# EAGLE design ChargerTimer_V3hack (EAGLE 6.4)
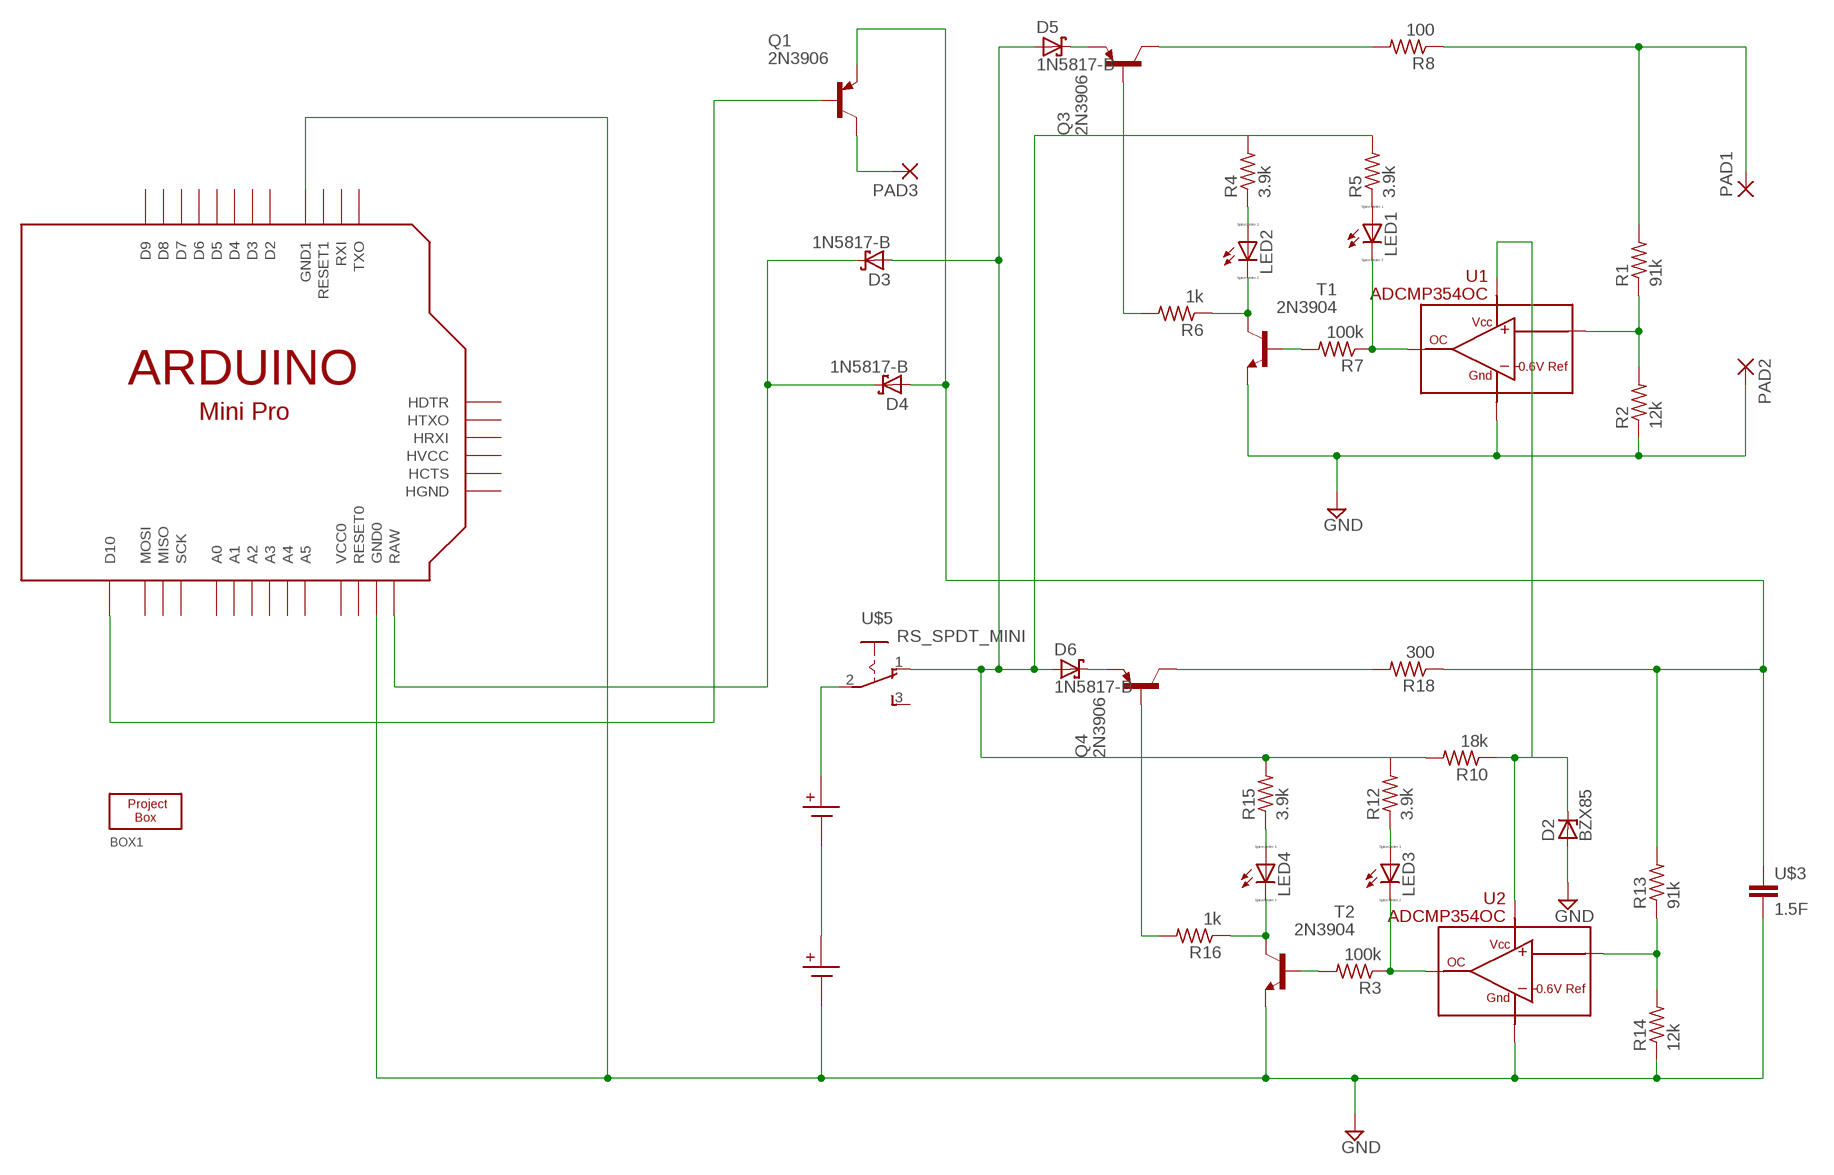
[diagram p0: schematic, sheet 1]

## Parts
BOX1  RS_BOX_4IN  [RS_BOX_OUTLINE_4IN]
D2  BZX85  [DO41Z10]
D3  1N5817-B  [DO41-7.6]
D4  1N5817-B  [DO41-7.6]
D5  1N5817-B  [DO41-7.6]
D6  1N5817-B  [DO41-7.6]
LED1  LED_ELD260  [LED_LD260]
LED2  LED_ELD260  [LED_LD260]
LED3  LED_ELD260  [LED_LD260]
LED4  LED_ELD260  [LED_LD260]
PAD1  2,15/1,0  [2,15/1,0]
PAD2  2,15/1,0  [2,15/1,0]
PAD3  2,15/1,0  [2,15/1,0]
Q1  2N3906  [TO92]
Q3  2N3906  [TO92]
Q4  2N3906  [TO92]
R1  91k  R-US_0207/7  [0207/7]
R2  12k  R-US_0207/7  [0207/7]
R3  100k  R-US_0207/7  [0207/7]
R4  3.9k  R-US_0207/7  [0207/7]
R5  3.9k  R-US_0207/7  [0207/7]
R6  1k  R-US_0207/7  [0207/7]
R7  100k  R-US_0207/7  [0207/7]
R8  100  R-US_0207/7  [0207/7]
R10  18k  R-US_0207/7  [0207/7]
R12  3.9k  R-US_0207/7  [0207/7]
R13  91k  R-US_0207/7  [0207/7]
R14  12k  R-US_0207/7  [0207/7]
R15  3.9k  R-US_0207/7  [0207/7]
R16  1k  R-US_0207/7  [0207/7]
R18  300  R-US_0207/7  [0207/7]
T1  2N3904  [TO92]
T2  2N3904  [TO92]
U1  ADCMP354OC  [ADCMP35X]
U2  ADCMP354OC  [ADCMP35X]
U$1  BH1000G  [BH1000G]
U$2  BH1000G  [BH1000G]
U$3  1.5F  C1000X850  [SUPERCAP1.0/0.85H]
U$4  ARDUINOMINI  [ARDUINOMINI]
U$5  RS_SPDT_MINI  [RS_SPDT_MINI]

## Nets
GND: D2.A PAD2.1(P) R2.1 R14.1 T1.3(E) T2.3(E) U1.P2(GND) U2.P2(GND) U$2.NEG$2(P2) U$3.P$2 U$4.P$9(GND1) U$4.P$20(GND0)
N$1: R1.1 R2.2 U1.P1(IN)
N$2: Q3.1(C) R8.2
N$3: LED1.K(C) R7.1 U1.P3(OUT)
N$4: LED1.A R5.1
N$5: LED2.A R4.1
N$6: LED2.K(C) R6.1 T1.1(C)
N$7: Q3.2(B) R6.2
N$8: PAD1.1(P) R1.2 R8.1
N$9: R3.2 T2.2(B)
N$10: D4.A Q1.3(E) R13.2 R18.1 U$3.P$1
N$11: U$1.POS$1(P1) U$5.2(P)
N$12: U$1.NEG$2(P2) U$2.POS$1(P1)
N$13: R7.2 T1.2(B)
N$15: D2.C R10.1 U1.P4(VCC) U2.P4(VCC)
N$16: R13.1 R14.2 U2.P1(IN)
N$17: LED3.K(C) R3.1 U2.P3(OUT)
N$18: LED3.A R12.1
N$19: LED4.A R15.1
N$20: LED4.K(C) R16.1 T2.1(C)
N$21: Q4.2(B) R16.2
N$22: Q4.1(C) R18.2
N$24: PAD3.1(P) Q1.1(C)
N$25: D3.C D4.C U$4.P$19(RAW)
N$26: Q1.2(B) U$4.P$30(D10)
N$28: D3.A D5.A D6.A R4.2 R5.2 R10.2 R12.2 R15.2 U$5.1(O)
N$29: D5.C Q3.3(E)
N$30: D6.C Q4.3(E)
Unconnected: U$4.P$1(D9) U$4.P$2(D8) U$4.P$3(D7) U$4.P$4(D6) U$4.P$5(D5) U$4.P$6(D4) U$4.P$7(D3) U$4.P$8(D2) U$4.P$10(RESET1) U$4.P$11(RXI) U$4.P$12(TXO) U$4.P$13(HDTR) U$4.P$14(HTXO) U$4.P$15(HRXI) U$4.P$16(HVCC) U$4.P$17(HCTS) U$4.P$18(HGND) U$4.P$21(RESET0) U$4.P$22(VCC0) U$4.P$23(A3) U$4.P$24(A2) U$4.P$25(A1) U$4.P$26(A0) U$4.P$27(SCK) U$4.P$28(MISO) U$4.P$29(MOSI) U$4.P$34(A4) U$4.P$35(A5) U$5.3(S)

## Library data of the parts
BOX1 = mymechanical:RS_BOX_4IN
D2 = diode:BZX85: Z DIODE
D3-D6 = diode:1N581*: 1.0A SCHOTTKY BARRIER RECTIFIER Source: http://www.diodes.com/datasheets/ds23001.pdf
LED1-LED4 = eagle-ltspice:LED_E: LED Source: http://www.osram.convergy.de Source: www.luxeon.com Source: www.kingbright.com; SPICEMODEL: NONE; SPICEPREFIX: D; SPICETYPE: diode
PAD1-PAD3 = wirepad:2,15/1,0: THROUGH-HOLE PAD
Q1 Q3 Q4 = transistor-pnp:2N3906: PNP Transistor
R1-R8 R10 R12-R16 R18 = rcl:R-US_: RESISTOR, American symbol
T1 T2 = transistor:2N3904: NPN TRANSISTOR
U1 U2 = mydevices:ADCMP354OC
U$1 U$2 = mymechanical:BH1000G: CR2477 Battery vertical holder
U$3 = mypassives:C1000X850
U$4 = adafruit:ARDUINOMINI
U$5 = mymechanical:RS_SPDT_MINI

## Board
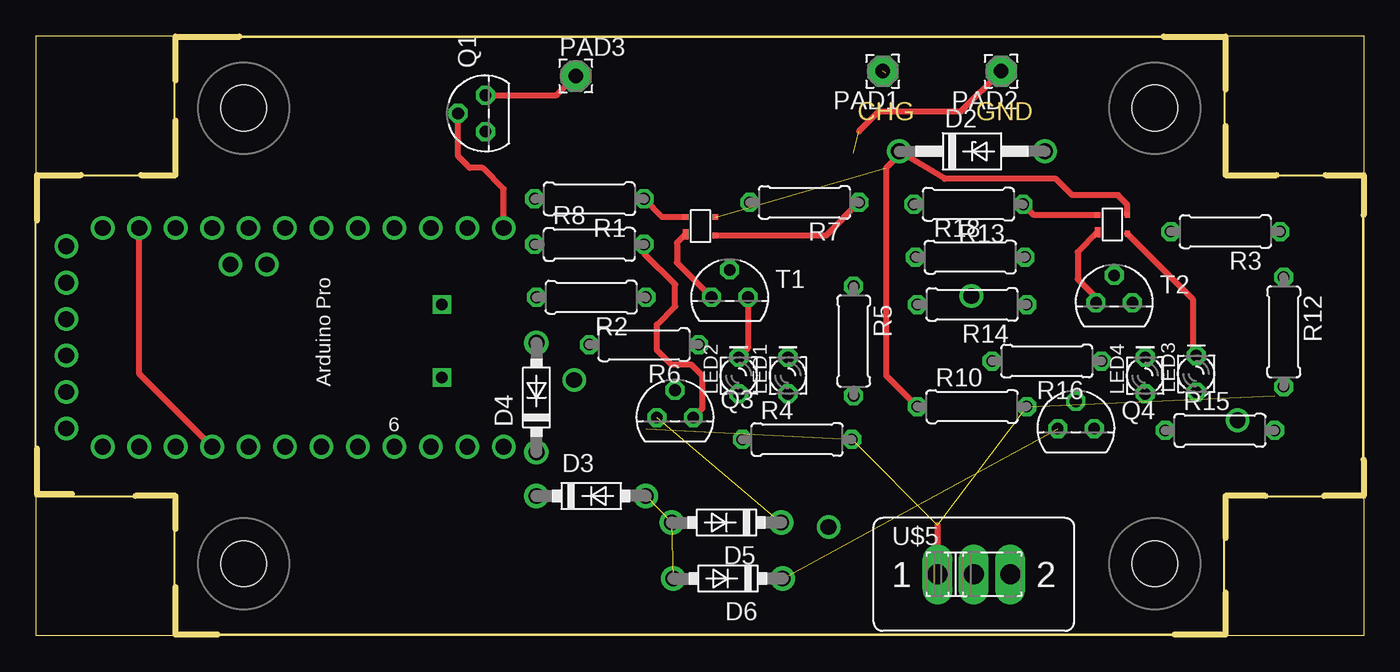
[diagram p1: board, top side]
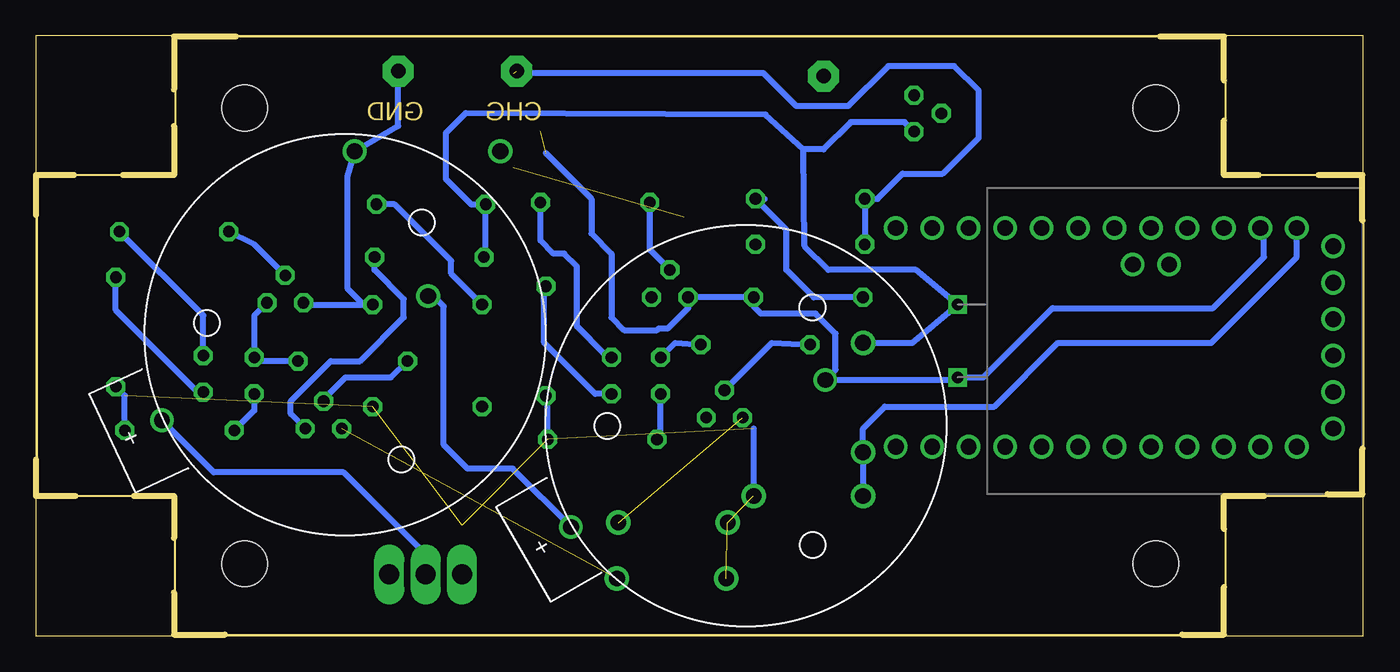
[diagram p2: board, bottom side, seen from below]

Size 92.53 x 41.8 mm. Coordinates in mm from the lower left corner, seen from the top.
Outline: 0.03,0 0.03,41.8 92.53,41.8 92.53,0 0.03,0
Copper layers (1*16): Top 0.035mm / dielectric 1.5mm / Bottom 0.035mm
Design rules "FarHorizonsMill": minimum track width 15mil, minimum drill 23mil, track to track 15mil, track to pad 15mil, pad to pad 15mil, via to via 15mil, smd to smd 8mil, copper to edge 40mil, drill to drill 20mil, minimum pad ring 10mil, minimum via ring 8mil, stop-mask expansion 4mil, vias tented up to drill 0mil, thermal gap 20mil
Milling: 24 lines

### Footprints (pad centres in the part's own frame; a part is rotated, then mirrored left to right if it is on the bottom)
RS_BOX_OUTLINE_4IN = hole 3.2: -31.75,15.875; -31.75,-15.875; 31.75,-15.875; 31.75,15.875
DO41Z10 = drill 1.118: A 5.08,0; C -5.08,0
DO41-7.6 = drill 1.1 pad 1.7: A 3.81,0; C -3.81,0
LED_LD260 = drill 0.813 octagon: A -1.27,0; K 1.27,0
2,15/1,0 = drill 1.016 pad 2.159 octagon: 1 0,0
TO92 = drill 0.813 octagon: 1 1.27,0; 2 0,1.905; 3 -1.27,0
0207/7 = drill 0.813 octagon: 1 -3.81,0; 2 3.81,0
ADCMP35X = smd 0.381 x 0.381: P1 -0.635,-1.041; P3 0.635,1.041; P4 -0.635,1.041 | smd 0.711 x 0.381: P2 0.559,-1.041
BH1000G = drill 1.1: NEG$2 0,-6.502; POS$1 0,13.97
SUPERCAP1.0/0.85H = drill 0.8 square: P$1 -2.54,-14.732; P$2 2.54,-14.732
ARDUINOMINI = drill 1.1: P$1 -7.62,-13.97; P$2 -7.62,-11.43; P$3 -7.62,-8.89; P$4 -7.62,-6.35; P$5 -7.62,-3.81; P$6 -7.62,-1.27; P$7 -7.62,3.81; P$8 -7.62,1.27; P$9 -7.62,6.35; P$10 -7.62,8.89; P$11 -7.62,11.43; P$12 -7.62,13.97; P$13 -6.35,16.51; P$14 -3.81,16.51; P$15 -1.27,16.51; P$16 1.27,16.51; P$17 3.81,16.51; P$18 6.35,16.51; P$19 7.62,13.97; P$20 7.62,11.43; P$21 7.62,8.89; P$22 7.62,6.35; P$23 7.62,3.81; P$24 7.62,1.27; P$25 7.62,-1.27; P$26 7.62,-3.81; P$27 7.62,-6.35; P$28 7.62,-8.89; P$29 7.62,-11.43; P$30 7.62,-13.97; P$34 5.08,5.08; P$35 5.08,2.54
RS_SPDT_MINI = drill 1.4 pad 2.032 long: 1 -2.54,0; 2 0,0; 3 2.54,0

### Placement (x,y rotation side)
BOX1  46.23,20.9 0 top
D2  65.24,33.75 0 top
D3  38.7,9.75 0 top
D4  34.89,16.61 90 top
D5  48.13,7.9 180 top
D6  48.23,4 180 top
LED1  52.41,18.13 90 top
LED2  48.98,18.13 90 top
LED3  80.86,18.26 90 top
LED4  77.31,18.13 90 top
PAD1  59.02,39.34 180 top
PAD2  67.27,39.34 180 top
PAD3  37.63,39 0 top
Q1  31.33,36.4 90 top
Q3  44.54,15.21 0 top
Q4  72.48,14.45 0 top
R1  38.57,30.45 180 top
R2  38.7,23.59 180 top
R3  82.89,28.16 180 top
R4  53.05,13.69 0 top
R5  56.99,20.54 270 top
R6  42.38,20.29 180 top
R7  53.56,30.2 180 top
R8  38.57,27.27 0 top
R10  65.24,15.97 0 top
R12  86.96,21.18 270 top
R13  64.99,30.07 180 top
R14  65.24,23.08 180 top
R15  82.51,14.32 0 top
R16  70.45,19.15 180 top
R18  65.11,26.39 0 top
T1  48.35,23.59 0 top
T2  75.15,23.21 0 top
U1  46.32,28.55 270 top
U2  75.02,28.67 270 top
U$1  71.08,20.93 115 bottom
U$2  43.14,14.57 120 bottom
U$3  13.55,20.54 270 bottom
U$4  18.63,20.8 90 top
U$5  65.37,4.29 0 top

### Tracks (layer width: path | path; a pad name or v marks a point on that pad's centre or on a via)
GND  (1 unrouted)
  Top 0.406: U2.P2 72.61,26.74 72.61,24.86 73.88,23.59 T2.3 | U$4.P$9 7.2,18.26 U$4.P$20 | U1.P2 44.67,27.38 44.67,26 T1.3 | 57.37,35.15 58.76,36.55 64.48,36.55 PAD2.1
  Bottom 0.406: T2.3 73.75,23.08 R14.1 69.69,23.08 70.83,24.23 70.83,31.97 D2.A 67.27,35.53 PAD2.1 | U$4.P$20 6.95,28.16 6.95,26.39 10.5,22.83 21.68,22.83 26.51,18 U$3.P$2 28.97,17.83 U$2.NEG$2 36.79,18.55 36.79,21.05 38.19,22.45 42,22.45 42.51,22.96 R2.1 T1.3 47.08,22.83 48.48,21.43 49.11,21.43 49.24,21.31 51.52,21.31 52.41,22.2 52.41,26.64 53.81,28.04 53.81,30.45 56.99,33.62
N$1
  Top 0.406: U1.P1 43.65,29.18 R1.1
  Bottom 0.406: 41.75,30.45 R1.1 40.22,28.29 40.22,25.5 38.32,23.59 R2.2
N$2
  Top 0.406: Q3.1 46.45,15.85 46.45,18.13 45.68,18.89 44.29,18.89 43.27,19.91 43.27,21.69 44.54,22.96 44.54,24.48 42.38,26.64 R8.2
N$3
  Top 0.406: U1.P3 55.08,27.91 R7.1
  Bottom 0.406: LED1.K 52.41,19.53 52.54,19.66 52.92,19.66 54.83,21.56 54.83,25.75 55.72,26.64 56.48,26.64 57.37,27.53 R7.1
N$4
  Bottom 0.406: LED1.A 53.56,16.86 57.11,20.42 57.11,24.23 R5.1
N$5
  Bottom 0.406: R4.1 48.98,13.94 LED2.A
N$6
  Top 0.406: T1.1 49.62,20.04 LED2.K
  Bottom 0.406: LED2.K 47.97,20.42 R6.1
N$7
  Bottom 0.406: Q3.2 41.24,20.42 R6.2
N$8  (1 unrouted)
  Bottom 0.406: R8.1 R1.2 33.88,30.45 32.13,32.2 29.33,32.2 26.83,34.7 26.83,38 28.53,39.7 33.13,39.7 35.93,36.9 39.53,36.9 41.83,39.2 59.23,39.2 59.63,39.6
N$9
  Bottom 0.406: T2.2 77.31,27.27 R3.2
N$10
  Bottom 0.406: R18.1 61.18,26.51 R13.2 62.19,30.07 63.97,31.85 63.97,35.02 62.57,36.42 41.68,36.32 39.05,33.9 | 39.05,33.9 38.95,27.15 37.3,25.5 31.2,25.5 U$3.P$1 31.46,20.42 D4.A | Q1.3 32,35.8 35.73,35.8 37.63,33.9 39.05,33.9
N$11
  Bottom 0.406: U$1.POS$1 80.12,11.4 71.08,11.4 65.37,5.68 U$5.2
N$12
  Bottom 0.406: U$1.NEG$2 64.81,23.67 64.1,22.96 64.1,13.3 62.45,11.65 59.3,11.65 U$2.POS$1
N$13
  Bottom 0.406: T1.2 49.75,26.89 R7.2
N$15  (1 unrouted)
  Top 0.406: R10.1 59.27,18.13 59.27,32.61 60.41,33.75 D2.C 63.34,31.85 71.08,31.85 72.23,30.7 75.4,30.7 76.06,30.04 U2.P4
N$16
  Top 0.406: U2.P1 69.56,29.31 R13.1
  Bottom 0.406: R14.2 63.59,25.24 63.59,26.13 67.53,30.07 R13.1
N$17
  Top 0.406: U2.P3 76.06,28.01 80.61,23.46 80.61,19.78 LED3.K
  Bottom 0.406: LED3.K 80.86,22.32 R3.1
N$18
  Bottom 0.406: LED3.A 81.24,16.99 86.96,22.7 R12.1
N$19
  Bottom 0.406: LED4.A 77.31,15.72 R15.1
N$20
  Bottom 0.406: T2.1 77.31,22.32 LED4.K 77.05,19.15 R16.1
N$21
  Bottom 0.406: Q4.2 72.48,16.48 70.96,18 67.78,18 R16.2
N$22
  Bottom 0.406: Q4.1 74.77,15.46 74.77,16.35 71.97,19.15 69.94,19.15 66.89,22.2 66.89,23.46 68.92,25.5 R18.2
N$24
  Top 0.406: Q1.1 36.3,37.67 PAD3.1
N$25
  Bottom 0.406: U$4.P$19 4.66,26.39 10.63,20.42 21.3,20.42 25.74,15.97 33.36,15.97 34.89,14.45 D4.C D3.C
N$26
  Top 0.406: U$4.P$30 32.6,31.13 31.13,32.6 30.23,32.6 29.43,33.4 Q1.2
N$28  (6 unrouted)
  Top 0.406: 62.83,7.72 U$5.1
  Bottom 0.406: R4.2 56.86,16.61 R5.2 | R15.2 86.32,16.73 R12.2 | 42.51,14.45 D3.A | 62.83,6.07 U$5.1
N$29  (1 unrouted)
N$30  (1 unrouted)

### Text on the board
Milling: CHG | GND